# Altium project WATERALARM_Project.PrjPcb
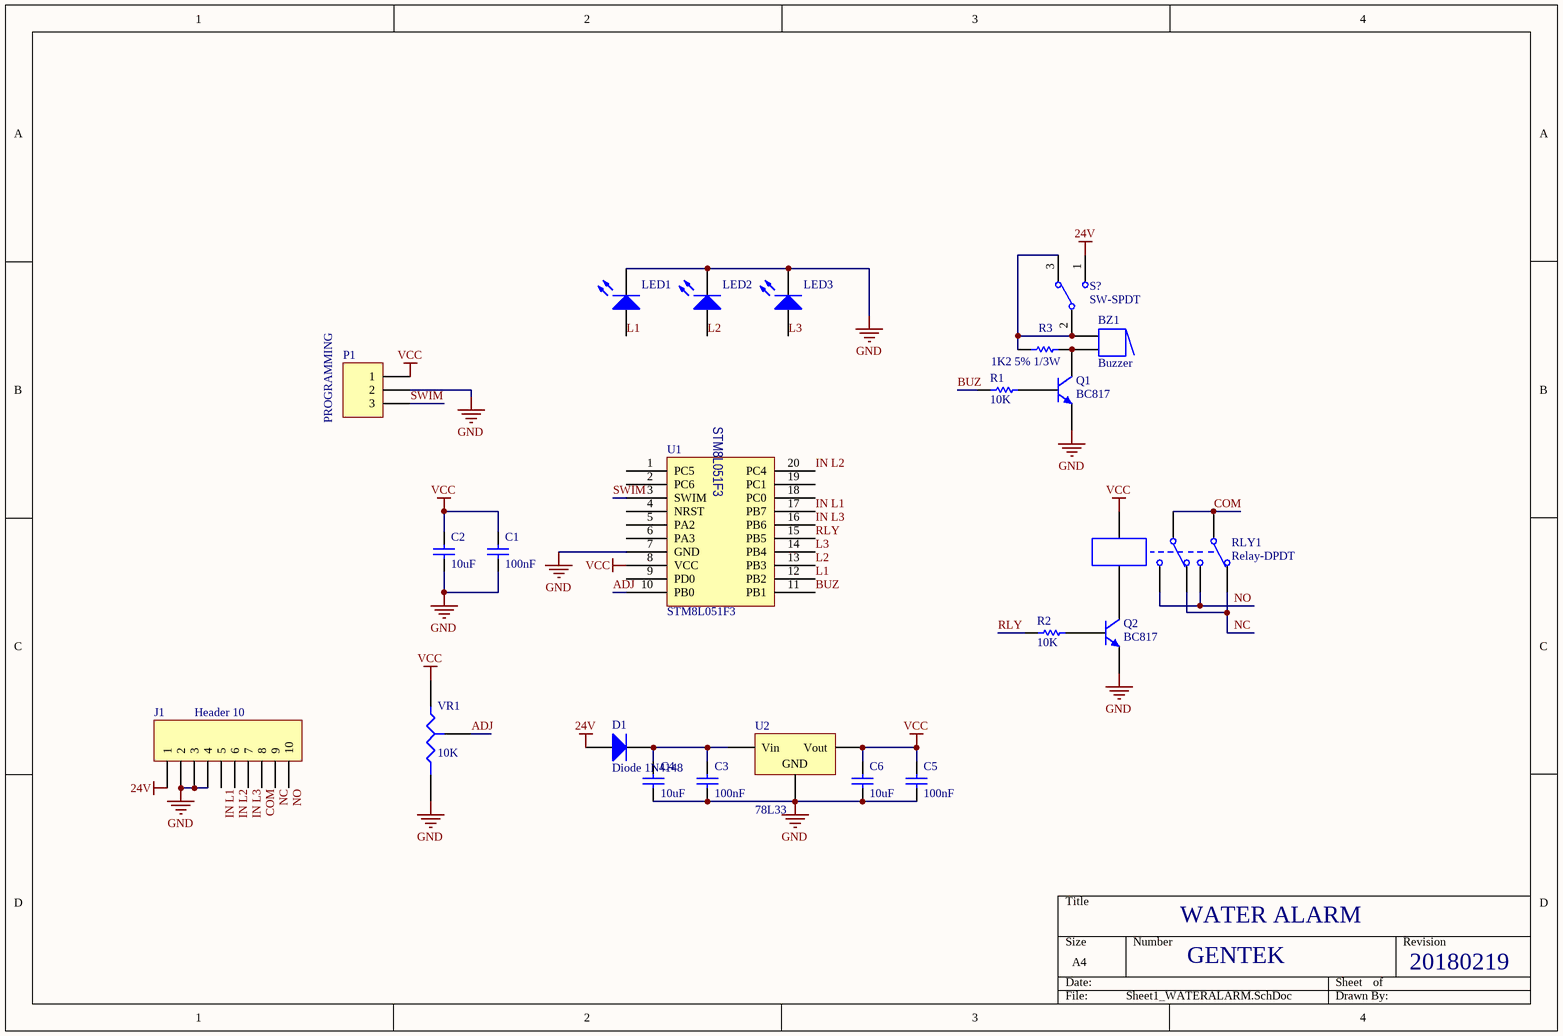
[diagram p0: Sheet1_WATERALARM.SchDoc]
1 sheet, 23 parts. Net scope: global (net labels, ports and power ports of the same name join across sheets).
Board files: WDpcb1u20180124.PcbDoc, WDpcb1u20180124.PcbDoc

## Sheet Sheet1_WATERALARM.SchDoc
size A4

### Parts
BZ1  Buzzer  [ABSM-1574]
C1  value 100nF  [RAD-0.3]  (hidden comment: Cap)
C2  value 10uF  [RAD-0.3]  (hidden comment: Cap)
C3  value 100nF  [RAD-0.3]  (hidden comment: Cap)
C4  value 10uF  [RAD-0.3]  (hidden comment: Cap)
C5  value 100nF  [RAD-0.3]  (hidden comment: Cap)
C6  value 10uF  [RAD-0.3]  (hidden comment: Cap)
D1  Diode 1N4148  [DO-35]
J1  Header 10  [HDR1X10]
LED1  BLUE  [3.2X1.6X1.1]  (value not drawn)
LED2  WHITE  [3.2X1.6X1.1]  (value not drawn)
LED3  GREEN  [3.2X1.6X1.1]  (value not drawn)
P1  PROGRAMMING  [HDR1X3]
Q1  BC817  [TO-226-AA]
Q2  BC817  [TO-226-AA]
R1  value 10K  [AXIAL-0.3]  (hidden comment: Res1)
R2  value 10K  [AXIAL-0.3]  (hidden comment: Res1)
R3  value 1K2 5% 1/3W  [AXIAL-0.3]  (hidden comment: Res1)
RLY1  Relay-DPDT  [DIP-P8]
S?  SW-SPDT  [TL36WW15050]
U1  STM8L051F3
U2  78L33  [D2PAK_N]
VR1  value 10K  [VR3]  (hidden comment: Res Tap)

### Nets
24V: D1.1(A) J1.1 S?.1
GND: C1.1 C2.1 C3.1 C4.1 C5.1 C6.1 J1.2 J1.3 J1.4 LED1.2(K) LED2.2(K) LED3.2(K) P1.2 Q1.3(E) Q2.3(E) U1.7(GND) U2.2(GND) VR1.2(B)
VCC: C1.2 C2.2 C5.2 C6.2 P1.1 RLY1.7 U1.8(VCC) U2.3(Vout) VR1.1(A)
ADJ: U1.10(PB0) VR1.3(TAP)
BUZ: R1.2 U1.11(PB1)
COM: J1.8 RLY1.1 RLY1.4
IN L1: J1.5 U1.17(PB7)
IN L2: J1.6 U1.20(PC4)
IN L3: J1.7 U1.16(PB6)
L1: LED1.1(A) U1.12(PB2)
L2: LED2.1(A) U1.13(PB3)
L3: LED3.1(A) U1.14(PB4)
NC: J1.9 RLY1.2 RLY1.5
NO: J1.10 RLY1.3 RLY1.6
RLY: R2.2 U1.15(PB5)
SWIM: P1.3 U1.3(SWIM)
NetBZ1_1: BZ1.1 BZ1.1A R3.2 S?.2 S?.3
NetBZ1_2: BZ1.2 BZ1.2A Q1.1(C) R3.1
NetC3_2: C3.2 C4.2 D1.2(K) U2.1(Vin)
NetQ1_2: Q1.2(B) R1.1
NetQ2_1: Q2.1(C) RLY1.8
NetQ2_2: Q2.2(B) R2.1

Not connected (* = marked no-connect by the designer): U1 1(PC5) 2(PC6) 4(NRST) 5(PA2) 6(PA3) 9(PD0) 18(PC0) 19(PC1)

### Notes on the sheet
- WATER ALARM
- GENTEK
- 20180219

### Library data of the parts
BZ1 = Buzzer: Magnetic Transducer Buzzer; Published: 24-Mar-1999; LatestRevisionDate: 17-Dec-2003; LatestRevisionNote: Schematic revised, PCB Footprint replaced.; DatasheetVersion: 17-Dec-2003; PackageReference: ABSM-1574; Publisher: Altium Limited; PackageDescription: Magnetic Transducer Buzzer; ComponentLink1Description: Manufacturer Link; ComponentLink1URL: http://www.megastar.com/linecard/buzzmode/index.php
C1-C6 = Cap: Capacitor; Published: 8-Jun-2000; LatestRevisionDate: 17-Jul-2002; LatestRevisionNote: Re-released for DXP Platform.; PackageReference: RAD-0.3; Publisher: Altium Limited; PackageDescription: Radial Cap, Thru-Hole; 2 Leads; 0.3 in Pin Spacing
D1 = Diode 1N4148: High Conductance Fast Diode; Published: 8-Jun-2000; LatestRevisionDate: 17-Jul-2002; LatestRevisionNote: Re-released for DXP Platform.; DatasheetVersion: 1997; PackageReference: DO-35; Publisher: Altium Limited; PackageDescription: Diode, Axial; Body 3.8 x 1.9 mm (LxDia. max), Lead Dia. 0.53 mm (max); Code_JEDEC: DO-204-AH; ComponentLink1Description: Manufacturer Link; ComponentLink1URL: http://www.fairchildsemi.com/; ComponentLink2Description: Datasheet; ComponentLink2URL: http://www.fairchildsemi.com/ds/1N%2F1N4148.pdf
J1 = Header 10: Header, 10-Pin; LatestRevisionDate: 17-Jul-2002; LatestRevisionNote: Re-released for DXP Platform.; Publisher: Altium Limited
LED1-LED3 = LED2: Typical RED, GREEN, YELLOW, AMBER GaAs LED; Published: 8-Jun-2000; LatestRevisionDate: 17-Jul-2002; LatestRevisionNote: Re-released for DXP Platform.; PackageVersion: Feb-2002; PackageReference: 3.2X1.6X1.1; Publisher: Altium Limited; PackageDescription: SM LED; 2 Flat Leads
P1 = Header 3: Header, 3-Pin; LatestRevisionDate: 17-Jul-2002; LatestRevisionNote: Re-released for DXP Platform.; Publisher: Altium Limited
Q1 Q2 = NPN: NPN Bipolar Transistor; Published: 8-Jun-2000; LatestRevisionDate: 17-Jul-2002; LatestRevisionNote: Re-released for DXP Platform.; PackageReference: TO-226-AA; Publisher: Altium Limited; PackageDescription: TO, Flat Index; 3 In-Line, Axial Leads; Body Dia. 4.8mm; Leads 0.55 x 0.51 mm (max); Code_JEDEC: TO-226-AA
R1-R3 = Res1: Resistor; Published: 8-Jun-2000; LatestRevisionDate: 17-Jul-2002; LatestRevisionNote: Re-released for DXP Platform.; PackageReference: AXIAL-0.3; Publisher: Altium Limited; PackageDescription: Axial Device, Thru-Hole; 2 Leads; 0.3 in Pin Spacing
RLY1 = Relay-DPDT: Dual-Pole Dual-Throw Relay; Published: 24-Mar-1999; LatestRevisionDate: 17-Jul-2002; LatestRevisionNote: Re-released for DXP Platform.; PackageReference: DIP-P8; Publisher: Altium Limited; PackageDescription: Relay; 8 Leads
S? = SW-SPDT: SPDT Subminiature Toggle Switch, Right Angle Mounting, Vertical Actuation; Published: 24-Mar-1999; LatestRevisionDate: 17-Dec-2003; LatestRevisionNote: Schematic revised, PCB Footprint replaced.; DatasheetVersion: 05-Dec-2000; PackageReference: TL36WW15050; Publisher: Altium Limited; PackageDescription: Switch; 4 Leads; ComponentLink1Description: Manufacturer Link; ComponentLink1URL: http://www.apem.com
U2 = Volt Reg: Voltage Regulator; Published: 24-Mar-1999; LatestRevisionDate: 29-May-2009; LatestRevisionNote: IPC-7351 Footprint Added.; PackageReference: D2PAK; Publisher: Altium Limited; PackageDescription: 3-Pin Transistor Outline Package 2.54 mm Pitch, 15.1 mm Lead Span
VR1 = Res Tap: Tapped Resistor; Sim Note: Enter the Resistance value and the set point into parameter fields.; Set Position: 0.5; Published: 24-Mar-1999; LatestRevisionDate: 17-Jul-2002; LatestRevisionNote: Re-released for DXP Platform.; PackageReference: VR3; Publisher: Altium Limited; PackageDescription: Variable Resistor, Thru-Hole; 3 Leads